# Altium schematic sheet Micro_Schematic.SchDoc
size B
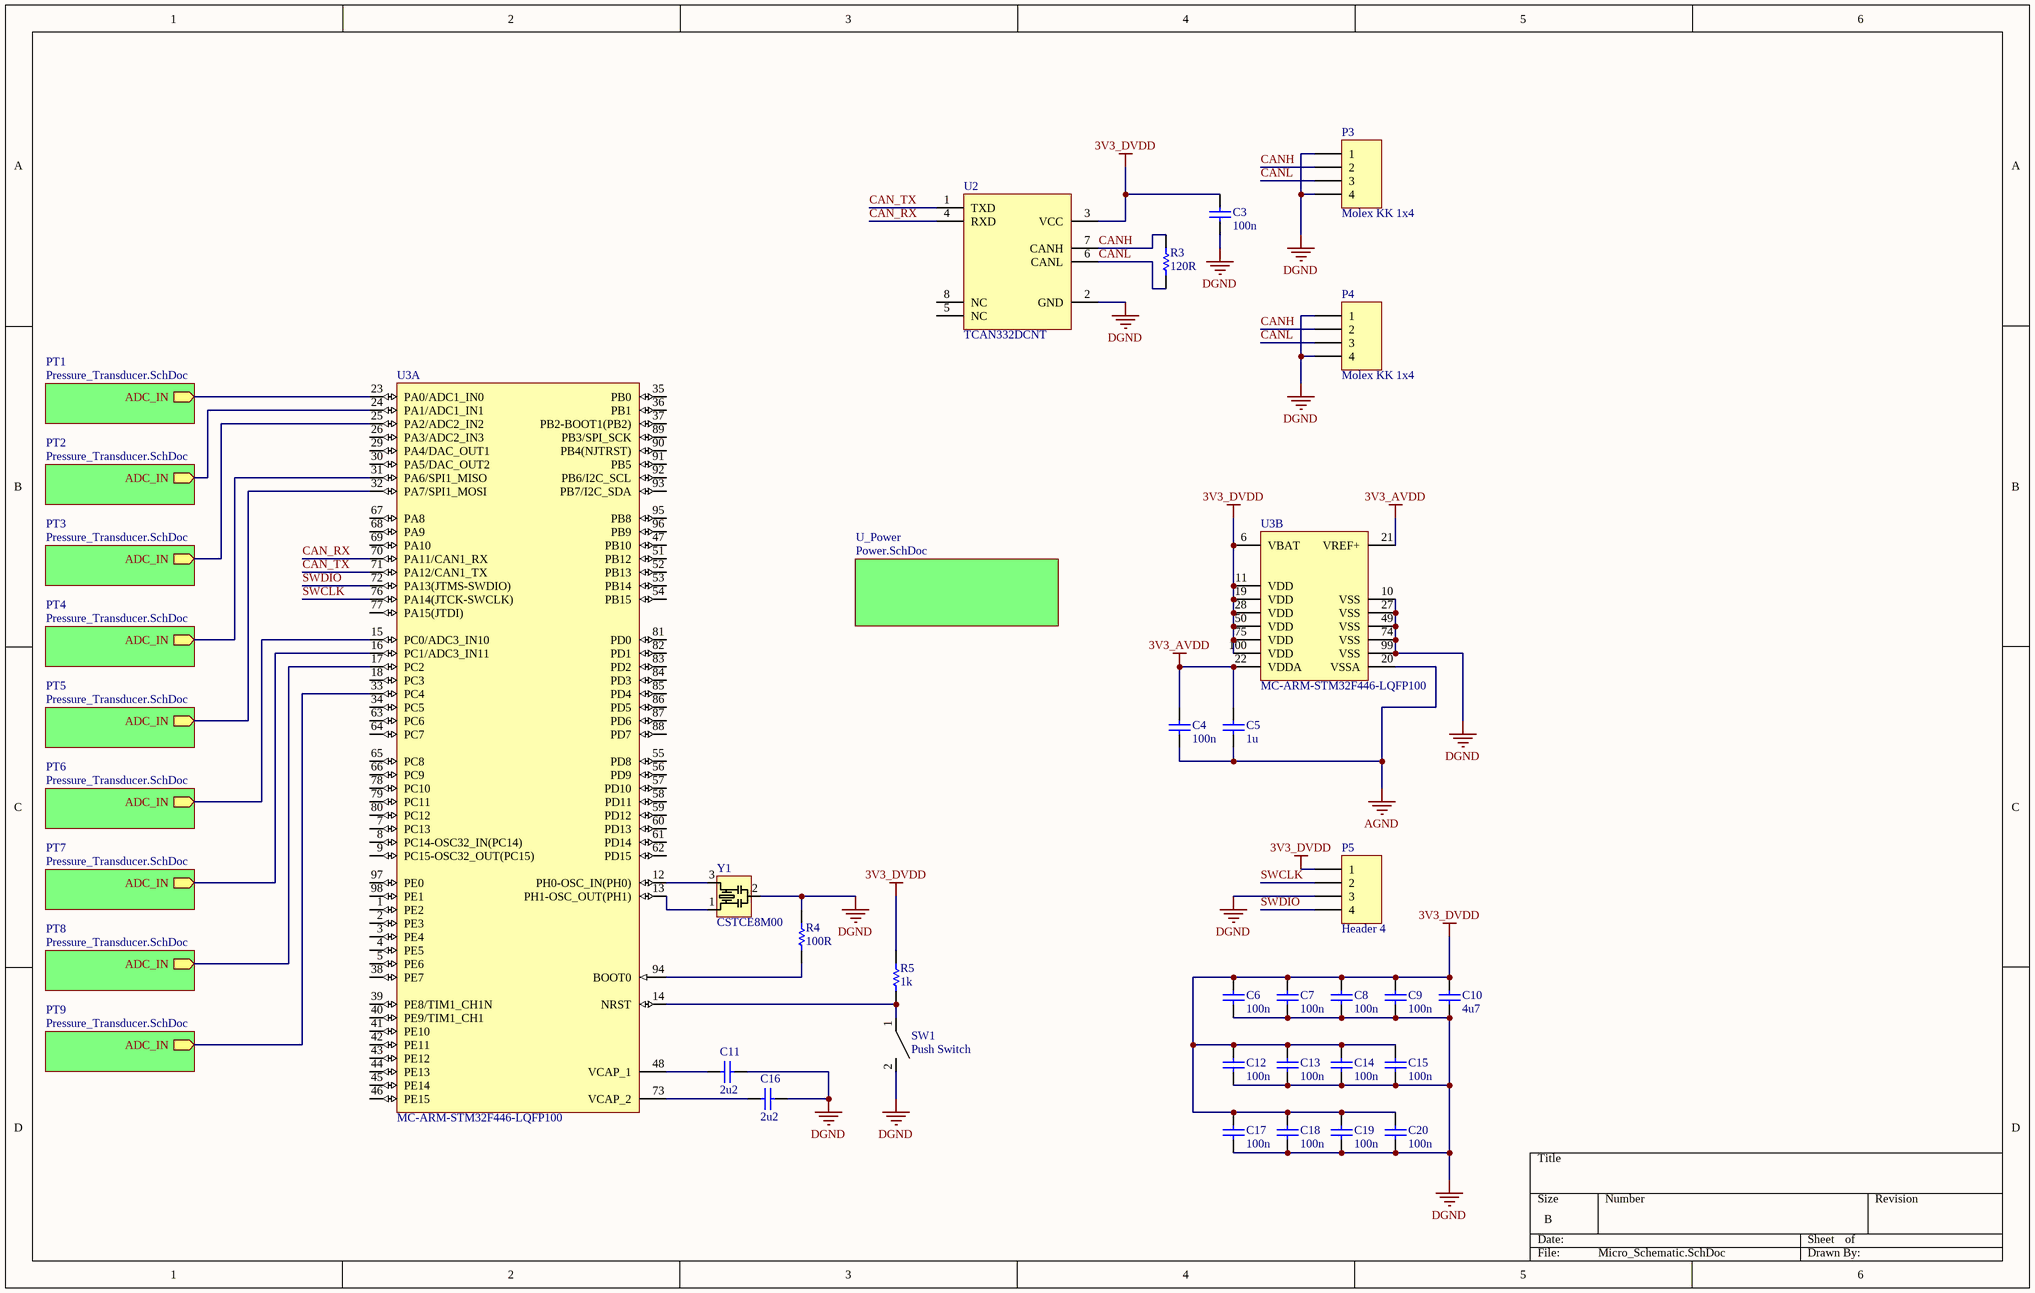
[diagram p0: Micro_Schematic.SchDoc]

## Parts
C3  100n  [C0805]
C4  100n  [C0805]
C5  1u  [C0805]
C6  100n  [C0805]
C7  100n  [C0805]
C8  100n  [C0805]
C9  100n  [C0805]
C10  4u7  [C0805]
C11  2u2  [C0805]
C12  100n  [C0805]
C13  100n  [C0805]
C14  100n  [C0805]
C15  100n  [C0805]
C16  2u2  [C0805]
C17  100n  [C0805]
C18  100n  [C0805]
C19  100n  [C0805]
C20  100n  [C0805]
P3  Molex KK 1x4  [Molex KK 4x1]
P4  Molex KK 1x4  [Molex KK 4x1]
P5  Header 4  [HDR1X4]
R3  120R  [R0805]
R4  100R  [R0805]
R5  1k  [R0805]
SW1  Push Switch  [PUSHBUTTON]
U2  TCAN332DCNT  [SOT-23-8]
U3  MC-ARM-STM32F446-LQFP100  [STM-LQFP100_N]  (parts A,B of 2)
Y1  CSTCE8M00  [8MHz Ceramic Resonator]

## Sub-sheets
PT1 = Pressure_Transducer.SchDoc: ADC_IN (out)
PT2 = Pressure_Transducer.SchDoc: ADC_IN (out)
PT3 = Pressure_Transducer.SchDoc: ADC_IN (out)
PT4 = Pressure_Transducer.SchDoc: ADC_IN (out)
PT5 = Pressure_Transducer.SchDoc: ADC_IN (out)
PT6 = Pressure_Transducer.SchDoc: ADC_IN (out)
PT7 = Pressure_Transducer.SchDoc: ADC_IN (out)
PT8 = Pressure_Transducer.SchDoc: ADC_IN (out)
PT9 = Pressure_Transducer.SchDoc: ADC_IN (out)
U_Power = Power.SchDoc: no entries

## Nets
3V3_AVDD: C4.1 C5.1 U3.21(VREF+) U3.22(VDDA)
3V3_DVDD: C3.1 C6.1 C7.1 C8.1 C9.1 C10.1 C12.1 C13.1 C14.1 C15.1 C17.1 C18.1 C19.1 C20.1 P5.1 R5.2 U2.3(VCC) U3.6(VBAT) U3.11(VDD) U3.19(VDD) U3.28(VDD) U3.50(VDD) U3.75(VDD) U3.100(VDD)
AGND: C4.2 C5.2 U3.20(VSSA)
DGND: C3.2 C6.2 C7.2 C8.2 C9.2 C10.2 C11.2 C12.2 C13.2 C14.2 C15.2 C16.2 C17.2 C18.2 C19.2 C20.2 P3.1 P3.4 P4.1 P4.4 P5.3 R4.1 SW1.2 U2.2(GND) U3.10(VSS) U3.27(VSS) U3.49(VSS) U3.74(VSS) U3.99(VSS) Y1.2(GND)
CAN_RX: U2.4(RXD) U3.70(PA11/CAN1_RX)
CAN_TX: U2.1(TXD) U3.71(PA12/CAN1_TX)
CANH: P3.2 P4.2 R3.2 U2.7(CANH)
CANL: P3.3 P4.3 R3.1 U2.6(CANL)
SWCLK: P5.2 U3.76(PA14(JTCK-SWCLK))
SWDIO: P5.4 U3.72(PA13(JTMS-SWDIO))
NetC11_1: C11.1 U3.48(VCAP_1)
NetC16_1: C16.1 U3.73(VCAP_2)
NetR4_2: R4.2 U3.94(BOOT0)
NetR5_1: R5.1 SW1.1 U3.14(NRST)
NetU3_12: U3.12(PH0-OSC_IN(PH0)) Y1.3(OSC2)
NetU3_13: U3.13(PH1-OSC_OUT(PH1)) Y1.1(OSC1)
NetU3_15: U3.15(PC0/ADC3_IN10) ; sheet PT6/ADC_IN
NetU3_16: U3.16(PC1/ADC3_IN11) ; sheet PT7/ADC_IN
NetU3_17: U3.17(PC2) ; sheet PT8/ADC_IN
NetU3_23: U3.23(PA0/ADC1_IN0) ; sheet PT1/ADC_IN
NetU3_24: U3.24(PA1/ADC1_IN1) ; sheet PT2/ADC_IN
NetU3_25: U3.25(PA2/ADC2_IN2) ; sheet PT3/ADC_IN
NetU3_31: U3.31(PA6/SPI1_MISO) ; sheet PT4/ADC_IN
NetU3_32: U3.32(PA7/SPI1_MOSI) ; sheet PT5/ADC_IN
NetU3_33: U3.33(PC4) ; sheet PT9/ADC_IN

Not connected (* = marked no-connect by the designer): U2 5(NC) 8(NC); U3 1(PE2) 2(PE3) 3(PE4) 4(PE5) 5(PE6) 7(PC13) 8(PC14-OSC32_IN(PC14)) 9(PC15-OSC32_OUT(PC15)) 18(PC3) 26(PA3/ADC2_IN3) 29(PA4/DAC_OUT1) 30(PA5/DAC_OUT2) 34(PC5) 35(PB0) 36(PB1) 37(PB2-BOOT1(PB2)) 38(PE7) 39(PE8/TIM1_CH1N) 40(PE9/TIM1_CH1) 41(PE10) 42(PE11) 43(PE12) 44(PE13) 45(PE14) 46(PE15) 47(PB10) 51(PB12) 52(PB13) 53(PB14) 54(PB15) 55(PD8) 56(PD9) 57(PD10) 58(PD11) 59(PD12) 60(PD13) 61(PD14) 62(PD15) 63(PC6) 64(PC7) 65(PC8) 66(PC9) 67(PA8) 68(PA9) 69(PA10) 77(PA15(JTDI)) 78(PC10) 79(PC11) 80(PC12) 81(PD0) 82(PD1) 83(PD2) 84(PD3) 85(PD4) 86(PD5) 87(PD6) 88(PD7) 89(PB3/SPI_SCK) 90(PB4(NJTRST)) 91(PB5) 92(PB6/I2C_SCL) 93(PB7/I2C_SDA) 95(PB8) 96(PB9) 97(PE0) 98(PE1)

## Library data of the parts
C3-C20 = C0805: 0805 Capacitor
  C3 C4 C6-C9 C12-C15 C17-C20: Value: 100n
  C5: Value: 1u
  C10: Value: 4u7
  C11 C16: Value: 2u2
P3 P4 = Molex KK 1x4: 1x4 Molex KK Connector
P5 = Header 4: Header, 4-Pin; LatestRevisionDate: 17-Jul-2002; LatestRevisionNote: Re-released for DXP Platform.; Publisher: Altium Limited
R3-R5 = R0805: RESISTOR 0805
  R3: Value: 120R
  R4: Value: 100R
  R5: Value: 1k
SW1 = PUSHBUTTON
U2 = TCAN332DCNT: IC TXRX CAN 3.3V SOT23-8
Y1 = CSTCE8M00: 8MHz Ceramic Resonator